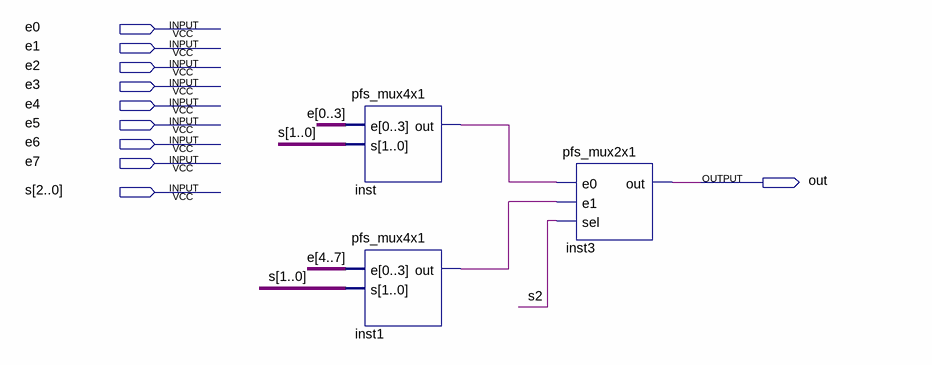
[diagram p0: schematic sheet]
// Quartus schematic pfs_mux8x1.bdf as structural Verilog: 3 symbols, 10 pins
module pfs_mux8x1 (
  input  e0,
  input  e1,
  input  e2,
  input  e3,
  input  e4,
  input  e5,
  input  e6,
  input  e7,
  input  [2:0] s,
  output out
);

  wire inst1_out, inst_out;

  pfs_mux4x1 inst (.e({e0, e1, e2, e3}), .s(s[1:0]), .out(inst_out));
  pfs_mux4x1 inst1 (.e({e4, e5, e6, e7}), .s(s[1:0]), .out(inst1_out));
  pfs_mux2x1 inst3 (.e0(inst_out), .e1(inst1_out), .sel(s[2]), .out(out));
endmodule
